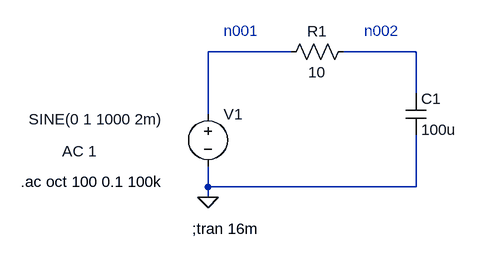
[diagram p0: schematic Yoneda-p66__Sine-wave_AC-analysis.asc]
Yoneda-p66__Sine-wave_AC-analysis.asc, the LTspice schematic file:
Version 4
SHEET 1 880 680
WIRE 432 -16 304 -16
WIRE 624 -16 512 -16
WIRE 624 48 624 -16
WIRE 304 80 304 -16
WIRE 304 192 304 160
WIRE 624 192 624 112
WIRE 624 192 304 192
WIRE 304 208 304 192
FLAG 304 208 0
SYMBOL voltage 304 64 R0
WINDOW 123 -224 73 Left 2
WINDOW 39 0 0 Left 2
WINDOW 3 -276 24 Left 2
SYMATTR Value2 AC 1
SYMATTR InstName V1
SYMATTR Value SINE(0 1 1000 2m)
SYMBOL cap 608 48 R0
SYMATTR InstName C1
SYMATTR Value 100u
SYMBOL res 416 0 R270
WINDOW 0 32 56 VTop 2
WINDOW 3 0 56 VBottom 2
SYMATTR InstName R1
SYMATTR Value 10
TEXT 280 256 Left 2 !;tran 16m
TEXT 328 -48 Left 2 ;n001
TEXT 544 -48 Left 2 ;n002
TEXT 16 184 Left 2 !.ac oct 100 0.1 100k

The netlist it stands for:
* Yoneda-p66__Sine-wave_AC-analysis.asc
V1 N001 0 SINE(0 1 1000 2m) AC 1
C1 N002 0 100u
R1 N001 N002 10
;tran 16m
* n001
* n002
.ac oct 100 0.1 100k
.backanno
.end